# Altium project TESTER_REMOTE_02.PrjPCB
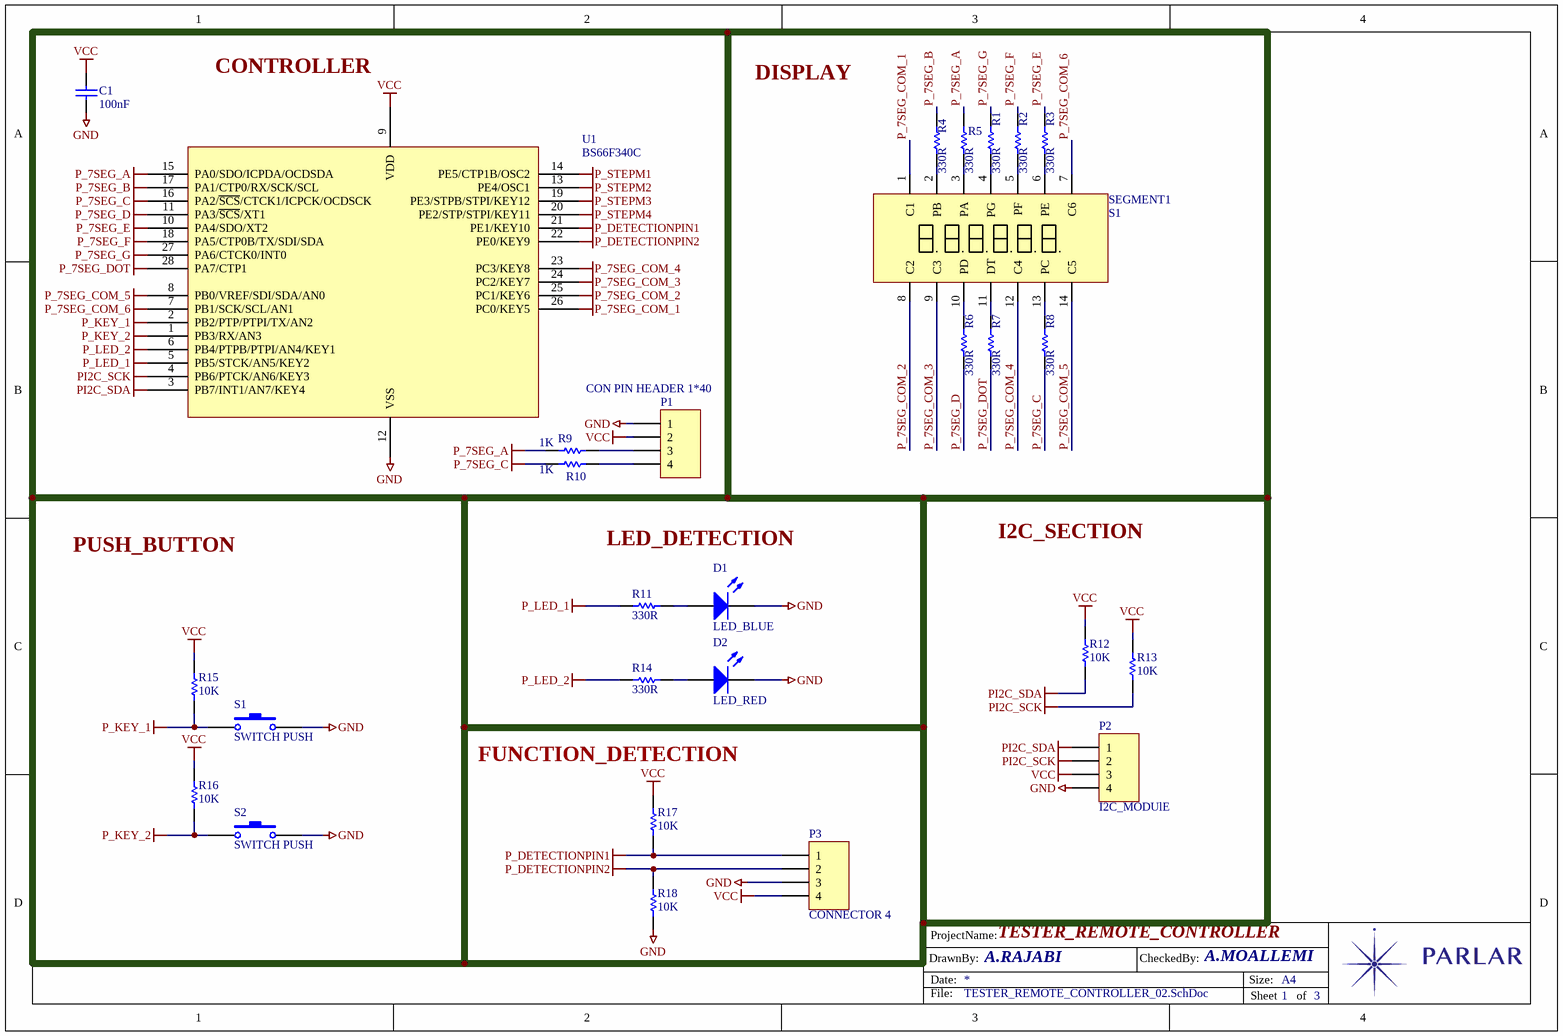
[diagram p0: TESTER_REMOTE_CONTROLLER_02.SchDoc]
3 sheets, 133 parts. Net scope: global (net labels, ports and power ports of the same name join across sheets).
Board file: TESTER_REMOTE_02.PcbDoc
Sheets:
  TESTER_REMOTE_CONTROLLER_02.SchDoc
  TESTER_REMOTE_STEPPER_DRIVER_02.SchDoc
  TESTER_REMOTE_SWITCHING_02.SchDoc

## Sheet TESTER_REMOTE_CONTROLLER_02.SchDoc: TESTER_REMOTE_CONTROLLER
size A4; CheckedBy: A.MOALLEMI; DrawnBy: A.RAJABI; SheetNumber: 1; SheetTotal: 3

### Parts
(Parts that share a designator on the sheet are numbered #1, #2 ... from top to bottom, then left to right.)
C1  100nF  [SMD 0805]
D1  LED_BLUE  [LED 5MM]
D2  LED_RED  [LED 5MM]
P1  CON PIN HEADER 1*40  [CON HDR 2.54FM 4]
P2  I2C_MODUlE  [CON HDR 2.54FM 4]
P3#1  CONNECTOR 4  [CON XH 4]
R1  330R  [SMD 1206]
R2  330R  [SMD 1206]
R3  330R  [SMD 1206]
R4  330R  [SMD 1206]
R5  330R  [SMD 1206]
R6  330R  [SMD 1206]
R7  330R  [SMD 1206]
R8  330R  [SMD 1206]
R9  1K  [SMD 0805]
R10  1K  [SMD 0805]
R11  330R  [SMD 0805]
R12  10K  [SMD 1206]
R13  10K  [SMD 0805]
R14  330R  [SMD 0805]
R15  10K  [SMD 0805]
R16  10K  [SMD 0805]
R17  10K  [SMD 0805]
R18  10K  [SMD 0805]
S1  SWITCH PUSH  [SW 6X6]
S2  SWITCH PUSH  [SW 6X6]
SEGMENT1  S1  [7SEG_6DIGIT]
U1  BS66F340C  [SMD IC SSOP28-HOLTEK]

### Nets
GND: C1.2 D1.2 D2.2 P1.1 P2.4 P3#1.3 R18.2 S1.2 S2.2 U1.12(VSS)
P_7SEG_A: R5.2 R9.1 U1.15(PA0/SDO/ICPDA/OCDSDA)
P_7SEG_B: R4.2 U1.17(PA1/CTP0/RX/SCK/SCL)
P_7SEG_C: R8.1 R10.1 U1.16(PA2/~{SCS}/CTCK1/ICPCK/OCDSCK)
P_7SEG_COM_1: SEGMENT1.1(C1) U1.26(PC0/KEY5)
P_7SEG_COM_2: SEGMENT1.8(C2) U1.25(PC1/KEY6)
P_7SEG_COM_3: SEGMENT1.9(C3) U1.24(PC2/KEY7)
P_7SEG_COM_4: SEGMENT1.12(C4) U1.23(PC3/KEY8)
P_7SEG_COM_5: SEGMENT1.14(C5) U1.8(PB0/VREF/SDI/SDA/AN0)
P_7SEG_COM_6: SEGMENT1.7(C6) U1.7(PB1/SCK/SCL/AN1)
P_7SEG_D: R6.1 U1.11(PA3/~{SCS}/XT1)
P_7SEG_DOT: R7.1 U1.28(PA7/CTP1)
P_7SEG_E: R3.1 U1.10(PA4/SDO/XT2)
P_7SEG_F: R2.2 U1.18(PA5/CTP0B/TX/SDI/SDA)
P_7SEG_G: R1.1 U1.27(PA6/CTCK0/INT0)
P_DETECTIONPIN1: P3#1.1 R17.2 U1.21(PE1/KEY10)
P_DETECTIONPIN2: P3#1.2 R18.1 U1.22(PE0/KEY9)
P_KEY_1: R15.1 S1.1 U1.2(PB2/PTP/PTPI/TX/AN2)
P_KEY_2: R16.1 S2.1 U1.1(PB3/RX/AN3)
P_LED_1: R11.1 U1.5(PB5/STCK/AN5/KEY2)
P_LED_2: R14.1 U1.6(PB4/PTPB/PTPI/AN4/KEY1)
P_STEPM1: U1.14(PE5/CTP1B/OSC2)
P_STEPM2: U1.13(PE4/OSC1)
P_STEPM3: U1.19(PE3/STPB/STPI/KEY12)
P_STEPM4: U1.20(PE2/STP/STPI/KEY11)
PI2C_SCK: P2.2 R13.1 U1.4(PB6/PTCK/AN6/KEY3)
PI2C_SDA: P2.1 R12.1 U1.3(PB7/INT1/AN7/KEY4)
VCC: C1.1 P1.2 P2.3 P3#1.4 R12.2 R13.2 R15.2 R16.2 R17.1 U1.9(VDD)
NetD1_1: D1.1 R11.2
NetD2_1: D2.1 R14.2
NetP1_3: P1.3 R9.2
NetP1_4: P1.4 R10.2
NetR1_2: R1.2 SEGMENT1.4(PG)
NetR2_1: R2.1 SEGMENT1.5(PF)
NetR3_2: R3.2 SEGMENT1.6(PE)
NetR4_1: R4.1 SEGMENT1.2(PB)
NetR5_1: R5.1 SEGMENT1.3(PA)
NetR6_2: R6.2 SEGMENT1.10(PD)
NetR7_2: R7.2 SEGMENT1.11(DT)
NetR8_2: R8.2 SEGMENT1.13(PC)

### Notes on the sheet
- FUNCTION_DETECTION
- Labels drawn without touching a wire or pin: CONTROLLER, DISPLAY, I2C_SECTION, LED_DETECTION, PUSH_BUTTON
- DrawnBy:
- ProjectName:
- Date:
- CheckedBy:
- Size:
- A4
- File:
- Sheet
- of

### Library data of the parts
C1 = CAP: Capacitor; Published: 8-Jun-2000; LatestRevisionDate: 17-Jul-2002; LatestRevisionNote: Re-released for DXP Platform.; PackageReference: RAD-0.3; Publisher: Altium Limited; PackageDescription: Radial Cap, Thru-Hole; 2 Leads; 0.3 in Pin Spacing
D1 D2 = LED: Typical INFRARED GaAs LED; Published: 8-Jun-2000; LatestRevisionDate: 08-Jul-2005; LatestRevisionNote: Mech Layer 1 removed.; PackageReference: LED-0; Publisher: Altium Limited; PackageDescription: LED; 2 Leads
P1 P2 P3#1 = CONNECTOR 4: Header, 4-Pin; LatestRevisionDate: 17-Jul-2002; LatestRevisionNote: Re-released for DXP Platform.; Publisher: Altium Limited
R1-R18 = RES: Resistor
S1 S2 = SWITCH PUSH: Switch; Published: 24-Mar-1999; LatestRevisionDate: 17-Jul-2002; LatestRevisionNote: Re-released for DXP Platform.; PackageReference: SPST-2; Publisher: Altium Limited; PackageDescription: Switch; 2 Leads
SEGMENT1 = 7SEG_6DIGIT
U1 = IC BS66F340C: Enhanced Touch A/D Flash MCU, 28-Pin

## Sheet TESTER_REMOTE_STEPPER_DRIVER_02.SchDoc: TESTER_REMOTE_CONTROLLER
size A4; CheckedBy: A_MOALLEMI; DrawnBy: A_RAJABI; SheetNumber: 3; SheetTotal: 3
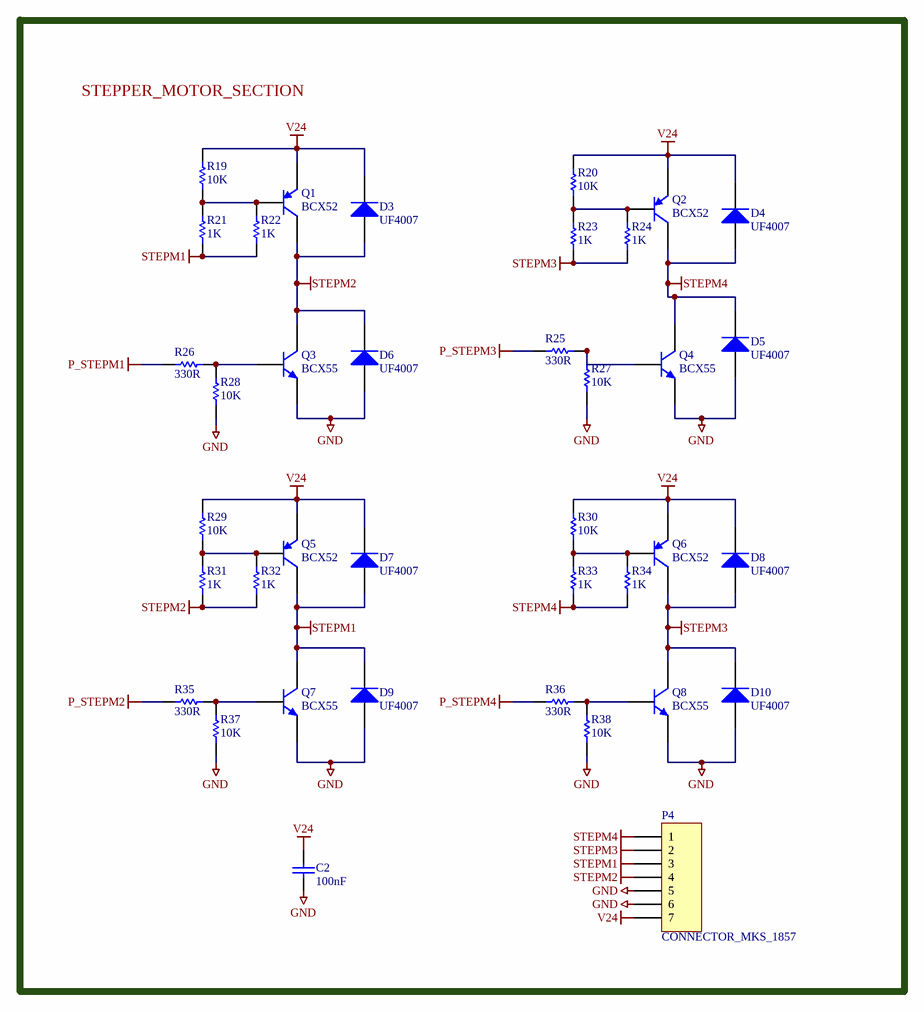
[diagram p1: TESTER_REMOTE_STEPPER_DRIVER_02.SchDoc]

### Parts
(Parts that share a designator on the sheet are numbered #1, #2 ... from top to bottom, then left to right.)
C2  100nF  [SMD 0805]
D3  UF4007  [SMD SMA]
D4  UF4007  [SMD SMA]
D5  UF4007  [SMD SMA]
D6  UF4007  [SMD SMA]
D7  UF4007  [SMD SMA]
D8  UF4007  [SMD SMA]
D9  UF4007  [SMD SMA]
D10  UF4007  [SMD SMA]
P4#1  CONNECTOR_MKS_1857  [CON MKS1857 7]
Q1  BCX52  [SMD SOT89 TRANSISTOR]
Q2  BCX52  [SMD SOT89 TRANSISTOR]
Q3  BCX55  [SMD SOT89 TRANSISTOR]
Q4  BCX55  [SMD SOT89 TRANSISTOR]
Q5  BCX52  [SMD SOT89 TRANSISTOR]
Q6  BCX52  [SMD SOT89 TRANSISTOR]
Q7  BCX55  [SMD SOT89 TRANSISTOR]
Q8  BCX55  [SMD SOT89 TRANSISTOR]
R19  10K  [SMD 1206]
R20  10K  [SMD 1206]
R21  1K  [SMD 1206]
R22  1K  [SMD 1206]
R23  1K  [SMD 1206]
R24  1K  [SMD 1206]
R25  330R  [SMD 1206]
R26  330R  [SMD 1206]
R27  10K  [SMD 0805]
R28  10K  [SMD 0805]
R29  10K  [SMD 1206]
R30  10K  [SMD 1206]
R31  1K  [SMD 1206]
R32  1K  [SMD 1206]
R33  1K  [SMD 1206]
R34  1K  [SMD 1206]
R35  330R  [SMD 1206]
R36  330R  [SMD 1206]
R37  10K  [SMD 0805]
R38  10K  [SMD 0805]

### Nets
GND: C2.2 D5.1 D6.1 D9.1 D10.1 P4#1.5 P4#1.6 Q3.2(E) Q4.2(E) Q7.2(E) Q8.2(E) R27.1 R28.1 R37.1 R38.1
P_STEPM1: R26.2
P_STEPM2: R35.2
P_STEPM3: R25.2
P_STEPM4: R36.2
STEPM1: D7.1 D9.2 P4#1.3 Q5.3(C) Q7.3(C) R21.1 R22.1
STEPM2: D3.1 D6.2 P4#1.4 Q1.3(C) Q3.3(C) R31.1 R32.1
STEPM3: D8.1 D10.2 P4#1.2 Q6.3(C) Q8.3(C) R23.1 R24.1
STEPM4: D4.1 D5.2 P4#1.1 Q2.3(C) Q4.3(C) R33.1 R34.1
V24: C2.1 D3.2 D4.2 D7.2 D8.2 P4#1.7 Q1.2(E) Q2.2(E) Q5.2(E) Q6.2(E) R19.2 R20.2 R29.2 R30.2
NetQ1_1: Q1.1(B) R19.1 R21.2 R22.2
NetQ2_1: Q2.1(B) R20.1 R23.2 R24.2
NetQ3_1: Q3.1(B) R26.1 R28.2
NetQ4_1: Q4.1(B) R25.1 R27.2
NetQ5_1: Q5.1(B) R29.1 R31.2 R32.2
NetQ6_1: Q6.1(B) R30.1 R33.2 R34.2
NetQ7_1: Q7.1(B) R35.1 R37.2
NetQ8_1: Q8.1(B) R36.1 R38.2

### Notes on the sheet
- STEPPER_MOTOR_SECTION
- DrawnBy:
- ProjectName:
- Date:
- CheckedBy:
- Size:
- A4
- File:
- Sheet
- of

### Library data of the parts
C2 = CAP: Capacitor; Published: 8-Jun-2000; LatestRevisionDate: 17-Jul-2002; LatestRevisionNote: Re-released for DXP Platform.; PackageReference: RAD-0.3; Publisher: Altium Limited; PackageDescription: Radial Cap, Thru-Hole; 2 Leads; 0.3 in Pin Spacing
D3-D10 = DIODE: Typical Diode
P4#1 = CONNECTOR 7: Header, 7-Pin; LatestRevisionDate: 17-Jul-2002; LatestRevisionNote: Re-released for DXP Platform.; Publisher: Altium Limited
Q1 Q2 Q5 Q6 = Q PNP: PNP Bipolar Transistor; Published: 8-Jun-2000; LatestRevisionDate: 29-May-2009; LatestRevisionNote: IPC-7351 Footprint Added.; PackageVersion: Aug-1999; PackageReference: SOT-23B; Publisher: Altium Limited; PackageDescription: 3-Pin SOT-23 Package 0.95 mm Pitch, 2.4 mm Lead Span
Q3 Q4 Q7 Q8 = Q NPN: NPN Bipolar Transistor; Published: 8-Jun-2000; LatestRevisionDate: 17-Jul-2002; LatestRevisionNote: Re-released for DXP Platform.; PackageReference: TO-226-AA; Publisher: Altium Limited; PackageDescription: TO, Flat Index; 3 In-Line, Axial Leads; Body Dia. 4.8mm; Leads 0.55 x 0.51 mm (max); Code_JEDEC: TO-226-AA
R19-R38 = RES: Resistor

## Sheet TESTER_REMOTE_SWITCHING_02.SchDoc: TESTER_REMOTE_CONTROLLER
size A4; CheckedBy: A_MOALLEMI; DrawnBy: A_RAJABI; SheetNumber: 2; SheetTotal: 3
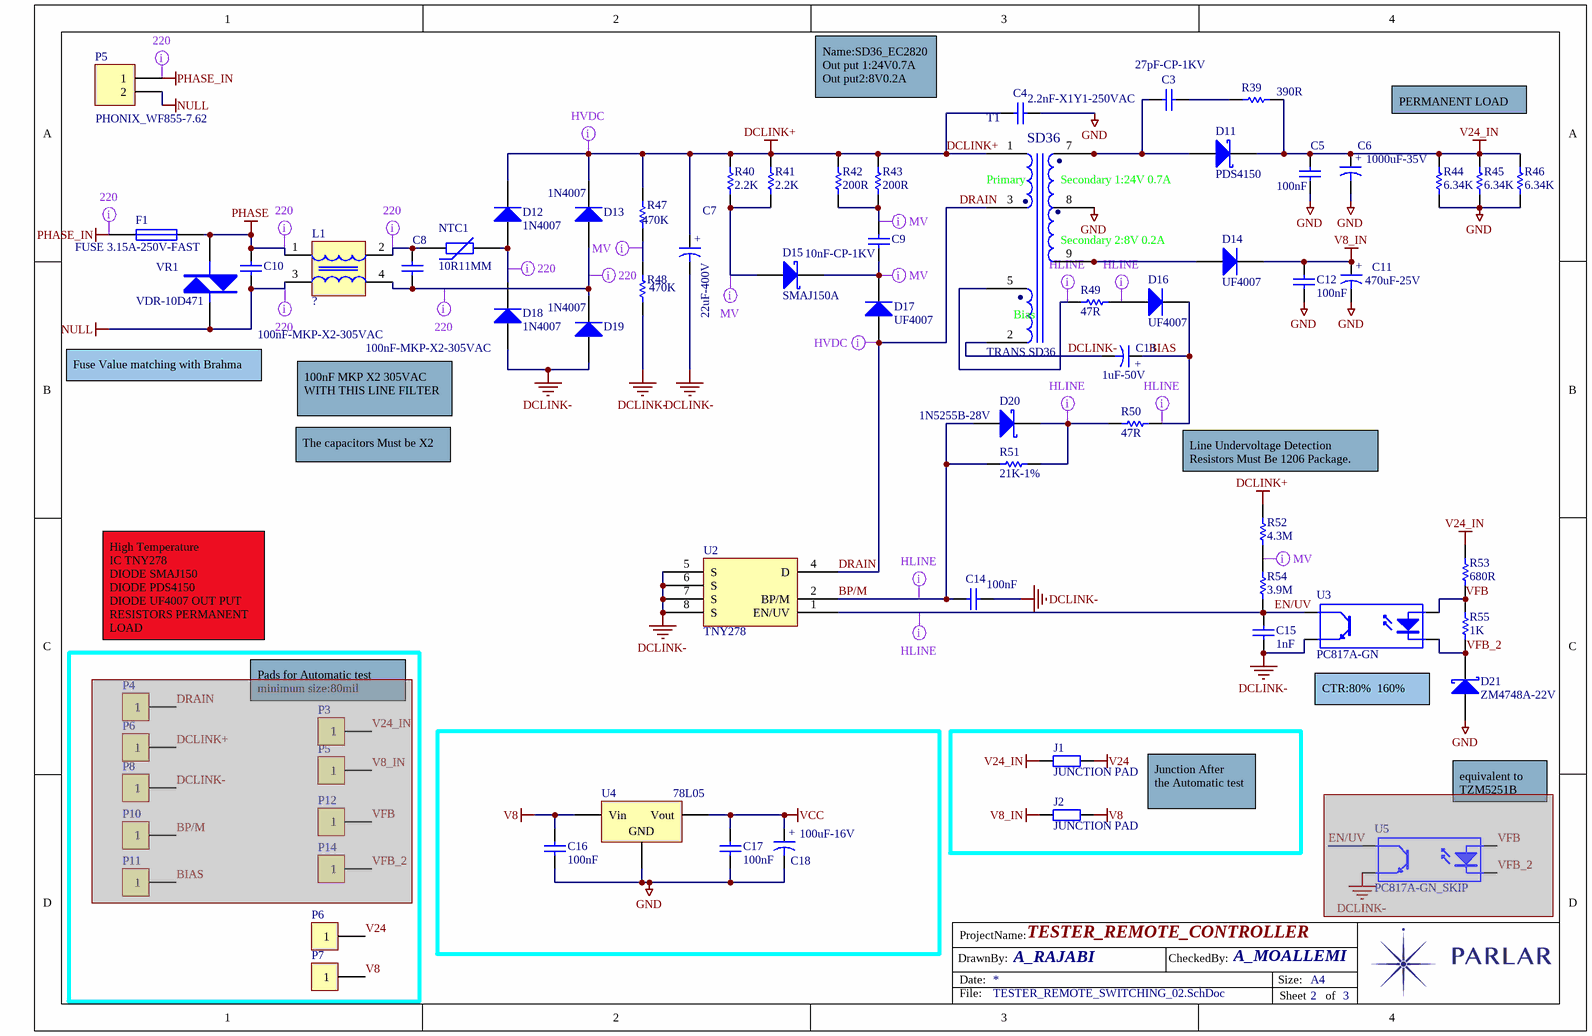
[diagram p2: TESTER_REMOTE_SWITCHING_02.SchDoc]

### Parts
(Parts that share a designator on the sheet are numbered #1, #2 ... from top to bottom, then left to right.)
C3  27pF-CP-1KV  [VDR D10 P7.5]
C4  2.2nF-X1Y1-250VAC  [VDR D10 P10]
C5  100nF  [SMD 0805]
C6  1000uF-35V  [CAP EL D13 P5]
C7  22uF-400V  [CAP EL D16 P5]
C8  100nF-MKP-X2-305VAC  [CAP RAD X13 Y5 P10]
C9  10nF-CP-1KV  [VDR D10 P7.5]
C10  100nF-MKP-X2-305VAC  [CAP RAD X13 Y5 P10]
C11  470uF-25V  [CAP EL D08 P3.5]
C12  100nF  [SMD 0805]
C13  1uF-50V  [CAP EL D06.3 P2.5]
C14  100nF  [SMD 0805]
C15  1nF  [SMD 0805]
C16  100nF  [SMD 0805]
C17  100nF  [SMD 0805]
C18  100uF-16V  [CAP EL D06.3 P2.5]
D11  PDS4150  [SMD POWERDI 5]
D12  1N4007  [SMD SMA]
D13  1N4007  [SMD SMA]
D14  UF4007  [SMD SMA]
D15  SMAJ150A  [SMD SMA]
D16  UF4007  [SMD SMA]
D17  UF4007  [SMD SMA]
D18  1N4007  [SMD SMA]
D19  1N4007  [SMD SMA]
D20  1N5255B-28V  [SMD MINIMELF SOD80]
D21  ZM4748A-22V  [SMD DO-41]
F1  FUSE 3.15A-250V-FAST  [FUSE P5.3MM H1.3MM]
J1  JUNCTION PAD  [PAD JUNCTION]
J2  JUNCTION PAD  [PAD JUNCTION]
L1  ?  [CH CCSP]
NTC1  10R11MM  [VDR D10 P7.5]
P3#2  CONNECTOR 1  [PAD TEST]  (value not drawn)  (masked out: inside a compile mask, not in the netlist)
P4#2  CONNECTOR 1  [PAD TEST]  (value not drawn)  (masked out: inside a compile mask, not in the netlist)
P5#1  PHONIX_WF855-7.62  [CON PHOENIX2 7.5 2]
P5#2  CONNECTOR 1  [PAD TEST]  (value not drawn)  (masked out: inside a compile mask, not in the netlist)
P6#1  CONNECTOR 1  [PAD TEST]  (value not drawn)  (masked out: inside a compile mask, not in the netlist)
P6#2  CONNECTOR 1  [PAD TEST]  (value not drawn)
P7  CONNECTOR 1  [PAD TEST]  (value not drawn)
P8  CONNECTOR 1  [PAD TEST]  (value not drawn)  (masked out: inside a compile mask, not in the netlist)
P10  CONNECTOR 1  [PAD TEST]  (value not drawn)  (masked out: inside a compile mask, not in the netlist)
P11  CONNECTOR 1  [PAD TEST]  (value not drawn)  (masked out: inside a compile mask, not in the netlist)
P12  CONNECTOR 1  [PAD TEST]  (value not drawn)  (masked out: inside a compile mask, not in the netlist)
P14  CONNECTOR 1  [PAD TEST]  (value not drawn)  (masked out: inside a compile mask, not in the netlist)
R39  390R  [SMD 1206]
R40  2.2K  [SMD 1206]
R41  2.2K  [SMD 1206]
R42  200R  [SMD 1206]
R43  200R  [SMD 1206]
R44  6.34K  [SMD 1206]
R45  6.34K  [SMD 1206]
R46  6.34K  [SMD 1206]
R47  470K  [SMD 1206]
R48  470K  [SMD 1206]
R49  47R  [SMD 1206]
R50  47R  [SMD 1206]
R51  21K-1%  [SMD 1206]
R52  4.3M  [SMD 1206]
R53  680R  [SMD 1206]
R54  3.9M  [SMD 1206]
R55  1K  [SMD 0805]
T1  TRANS SD36  [TR EC28/20 VER 5+5]
U2  TNY278  [DIP8]
U3  PC817A-GN  [DIP4]
U4  78L05  [SMD DPAK]
U5  PC817A-GN_SKIP  [SMD IC SOP4]  (masked out: inside a compile mask, not in the netlist)
VR1  VDR-10D471  [VDR D10 P7.5]

### Nets
DCLINK+: C4.2 C7.1 D12.2 D13.2 R40.2 R41.2 R42.2 R43.2 R47.2 R52.2 T1.1
DCLINK-: C7.2 C13.2 C14.2 C15.2 D18.1 D19.1 R48.1 T1.2 U2.5(S) U2.6(S) U2.7(S) U2.8(S) U3.3(E)
GND: C4.1 C5.2 C6.2 C11.2 C12.2 C16.2 C17.2 C18.2 D21.1 R44.2 R45.2 R46.2 T1.8 U4.2(GND)
NULL: C10.2 L1.3 P5#1.2 VR1.1
PHASE: C10.1 F1.2 L1.1 VR1.2
PHASE_IN: F1.1 P5#1.1
V8: C16.1 J2.2 P7.1 U4.1(Vin)
V8_IN: C11.1 C12.1 D14.2 J2.1
V24: J1.2 P6#2.1
V24_IN: C5.1 C6.1 D11.2 J1.1 R39.2 R44.1 R45.1 R46.1 R53.2
VCC: C17.1 C18.1 U4.3(Vout)
BIAS: C13.1 D16.2 R50.1
BP/M: C14.1 D20.1 R51.2 U2.2(BP/M)
DRAIN: D17.1 T1.3 U2.4(D)
EN/UV: C15.1 R54.1 U2.1(EN/UV) U3.4(C)
VFB: R53.1 R55.2 U3.1(A)
VFB_2: D21.2 R55.1 U3.2(K)
NetC3_1: C3.1 R39.1
NetC3_2: C3.2 D11.1 T1.6 T1.7
NetC8_1: C8.1 L1.2 NTC1.1
NetC8_2: C8.2 D13.1 D19.2 L1.4
NetC9_1: C9.1 R42.1 R43.1
NetC9_2: C9.2 D15.2 D17.2
NetD12_1: D12.1 D18.2 NTC1.2
NetD14_1: D14.1 T1.9 T1.10
NetD15_1: D15.1 R40.1 R41.1
NetD16_1: D16.1 R49.1
NetD20_2: D20.2 R50.2 R51.1
NetR47_1: R47.1 R48.2
NetR49_2: R49.2 T1.5
NetR52_1: R52.1 R54.2

### Layout directives
net class 220: NetC8_1, NetC8_2, NetD12_1, NULL, PHASE, PHASE_IN
net class HVDC: DCLINK+, DRAIN
net class MV: NetC9_1, NetC9_2, NetD15_1, NetR47_1, NetR52_1
net class Hline: BIAS, BP/M, EN/UV, NetD16_1, NetD20_2, NetR49_2

### Notes on the sheet
- Name:SD36_EC2820
  Out put 1:24V0.7A
  Out put2:8V0.2A
- PERMANENT LOAD
- Fuse Value matching with Brahma
- 100nF MKP X2 305VAC WITH THIS LINE FILTER
- The capacitors Must be X2
- Line Undervoltage Detection Resistors Must Be 1206 Package.
- High Temperature
  IC TNY278
  DIODE SMAJ150
  DIODE PDS4150
  DIODE UF4007 OUT PUT
  RESISTORS PERMANENT LOAD
- (near P3#2) Pads for Automatic test
  minimum size:80mil
- CTR:80%  160%
- Junction After      the Automatic test
- equivalent to TZM5251B
- DrawnBy:
- ProjectName:
- Date:
- CheckedBy:
- Size:
- A4
- File:
- Sheet
- of
- (in symbol CAP POL) +
- (in symbol TRANS SD36) SD36; .; Primary; Secondary 1:24V 0.7A; Secondary 2:8V 0.2A; Bias

### Library data of the parts
C3-C5 C8-C10 C12 C14-C17 = CAP: Capacitor; Published: 8-Jun-2000; LatestRevisionDate: 17-Jul-2002; LatestRevisionNote: Re-released for DXP Platform.; PackageReference: RAD-0.3; Publisher: Altium Limited; PackageDescription: Radial Cap, Thru-Hole; 2 Leads; 0.3 in Pin Spacing
C6 C7 C11 C13 C18 = CAP POL: Capacitor  Polarized; Published: 23-Sep-2002; PackageReference: CAPR5-4X5; Publisher: Altium Limited; PackageDescription: Capacitor; 2 Leads; Parameter 1: *
D11 = DIODE SCHOTTKY: Schottky Diode
D12-D14 D16-D19 = DIODE: Typical Diode
D15 D20 D21 = DIODE ZENER: Zener Diode
F1 = FUSE: Published: 8-Jun-2000; LatestRevisionDate: 17-Jul-2002; LatestRevisionNote: Re-released for DXP Platform.; PackageReference: PIN-W2/E2.8; Publisher: Altium Limited; PackageDescription: Thru-Hole; 2 Leads
J1 J2 = RES JUNCTION: Resistor; Published: 8-Jun-2000; LatestRevisionDate: 17-Jul-2002; LatestRevisionNote: Re-released for DXP Platform.; PackageReference: AXIAL-0.4; Publisher: Altium Limited; PackageDescription: Axial Device, Thru-Hole; 2 Leads; 0.4 in Pin Spacing
L1 = EMI FILTER
NTC1 = RES VARISTOR: Varistor (Voltage-Sensitive Resistor); Published: 24-Mar-1999; LatestRevisionDate: 29-May-2009; LatestRevisionNote: IPC-7351 Footprint Added.; PackageVersion: Mar-2003; PackageReference: 6-0805; Publisher: Altium Limited; PackageDescription: Chip Resistor 0805 Case Size; Code_IPC: RESC2012
P3#2 P4#2 P5#2 P6#1 P6#2 P7 P8 P10-P12 P14 = CONNECTOR 1: The BS81x is a series of 2~16 key touch key devices; LatestRevisionDate: 17-Jul-2002; LatestRevisionNote: Re-released for DXP Platform.; Publisher: Altium Limited
P5#1 = CONNECTOR 2: Header, 2-Pin; LatestRevisionDate: 17-Jul-2002; LatestRevisionNote: Re-released for DXP Platform.; Publisher: Altium Limited
R39-R55 = RES: Resistor
T1 = TRANS SD36: Transformer
U2 = IC TNY274: AC to DC Switching Converter Off-Line Switcher 140kHz, 7-Pin
U3 U5 = OPTO COPLER: 4-Pin Phototransistor Optocoupler; Published: 24-Mar-1999; LatestRevisionDate: 04-Mar-2005; LatestRevisionNote: Sch pins 3 & 4 Swapped.; DatasheetVersion: Nov-2003; PackageReference: DIP-4; Publisher: Altium Limited
U4 = VOLT REG: Voltage Regulator; Published: 24-Mar-1999; LatestRevisionDate: 29-May-2009; LatestRevisionNote: IPC-7351 Footprint Added.; PackageReference: D2PAK; Publisher: Altium Limited; PackageDescription: 3-Pin Transistor Outline Package 2.54 mm Pitch, 15.1 mm Lead Span
VR1 = VDR: Typical VDR

## Nets that join several sheets
GND: TESTER_REMOTE_CONTROLLER_02 (10 pins), TESTER_REMOTE_STEPPER_DRIVER_02 (15 pins), TESTER_REMOTE_SWITCHING_02 (14 pins)
P_STEPM1: TESTER_REMOTE_CONTROLLER_02 (U1.14), TESTER_REMOTE_STEPPER_DRIVER_02 (R26.2)
P_STEPM2: TESTER_REMOTE_CONTROLLER_02 (U1.13), TESTER_REMOTE_STEPPER_DRIVER_02 (R35.2)
P_STEPM3: TESTER_REMOTE_CONTROLLER_02 (U1.19), TESTER_REMOTE_STEPPER_DRIVER_02 (R25.2)
P_STEPM4: TESTER_REMOTE_CONTROLLER_02 (U1.20), TESTER_REMOTE_STEPPER_DRIVER_02 (R36.2)
V24: TESTER_REMOTE_STEPPER_DRIVER_02 (14 pins), TESTER_REMOTE_SWITCHING_02 (J1.2 P6#2.1)
VCC: TESTER_REMOTE_CONTROLLER_02 (10 pins), TESTER_REMOTE_SWITCHING_02 (C17.1 C18.1 U4.3)